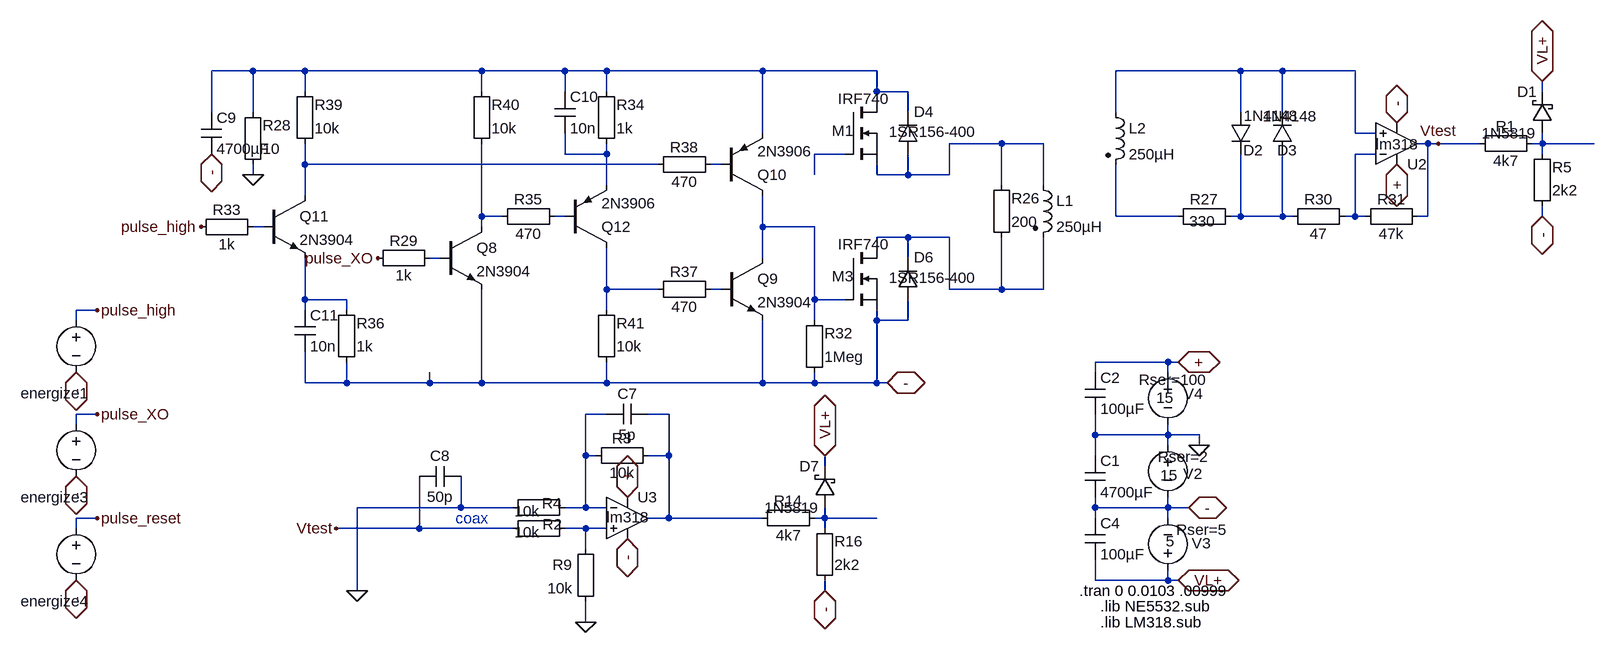
[diagram p0: schematic metal_low_power_fast_switch_ZVT_10.asc]
metal_low_power_fast_switch_ZVT_10.asc, the LTspice schematic file:
Version 4
SHEET 1 6068 1612
WIRE 96 -2432 32 -2432
WIRE 176 -2432 96 -2432
WIRE 448 -2432 176 -2432
WIRE 576 -2432 448 -2432
WIRE 640 -2432 576 -2432
WIRE 880 -2432 640 -2432
WIRE 1056 -2432 880 -2432
WIRE 1616 -2432 1424 -2432
WIRE 1680 -2432 1616 -2432
WIRE 1792 -2432 1680 -2432
WIRE 176 -2400 176 -2432
WIRE 448 -2400 448 -2432
WIRE 576 -2400 576 -2432
WIRE 640 -2400 640 -2432
WIRE 1056 -2400 1056 -2432
WIRE 1104 -2400 1056 -2400
WIRE 2080 -2400 2080 -2416
WIRE 1056 -2384 1056 -2400
WIRE 32 -2368 32 -2432
WIRE 96 -2368 96 -2432
WIRE 1104 -2368 1104 -2400
WIRE 1424 -2368 1424 -2432
WIRE 1616 -2368 1616 -2432
WIRE 1680 -2368 1680 -2432
WIRE 880 -2336 880 -2432
WIRE 1792 -2336 1792 -2432
WIRE 1824 -2336 1792 -2336
WIRE 1248 -2320 1168 -2320
WIRE 1312 -2320 1248 -2320
WIRE 1904 -2320 1888 -2320
WIRE 1920 -2320 1904 -2320
WIRE 1984 -2320 1920 -2320
WIRE 2080 -2320 2080 -2336
WIRE 2080 -2320 2064 -2320
WIRE 2160 -2320 2080 -2320
WIRE 576 -2304 576 -2336
WIRE 640 -2304 640 -2320
WIRE 640 -2304 576 -2304
WIRE 1008 -2304 960 -2304
WIRE 1824 -2304 1792 -2304
WIRE 2080 -2304 2080 -2320
WIRE 176 -2288 176 -2320
WIRE 720 -2288 176 -2288
WIRE 816 -2288 800 -2288
WIRE 96 -2272 96 -2288
WIRE 960 -2272 960 -2304
WIRE 1056 -2272 1056 -2288
WIRE 1104 -2272 1104 -2304
WIRE 1104 -2272 1056 -2272
WIRE 1168 -2272 1168 -2320
WIRE 1168 -2272 1104 -2272
WIRE 640 -2256 640 -2304
WIRE 1248 -2256 1248 -2320
WIRE 1312 -2256 1312 -2320
WIRE 176 -2240 176 -2288
WIRE 448 -2208 448 -2320
WIRE 480 -2208 448 -2208
WIRE 576 -2208 560 -2208
WIRE 1424 -2208 1424 -2288
WIRE 1520 -2208 1424 -2208
WIRE 1616 -2208 1616 -2304
WIRE 1616 -2208 1600 -2208
WIRE 1680 -2208 1680 -2304
WIRE 1680 -2208 1616 -2208
WIRE 1696 -2208 1680 -2208
WIRE 1792 -2208 1792 -2304
WIRE 1792 -2208 1776 -2208
WIRE 1808 -2208 1792 -2208
WIRE 1904 -2208 1904 -2320
WIRE 1904 -2208 1888 -2208
WIRE 2080 -2208 2080 -2224
WIRE 112 -2192 96 -2192
WIRE 448 -2192 448 -2208
WIRE 880 -2192 880 -2240
WIRE 960 -2192 880 -2192
WIRE 1104 -2176 1056 -2176
WIRE 1168 -2176 1104 -2176
WIRE 1056 -2160 1056 -2176
WIRE 384 -2144 368 -2144
WIRE 880 -2144 880 -2192
WIRE 1104 -2144 1104 -2176
WIRE 640 -2096 640 -2160
WIRE 720 -2096 640 -2096
WIRE 816 -2096 800 -2096
WIRE 1168 -2096 1168 -2176
WIRE 1248 -2096 1248 -2176
WIRE 1248 -2096 1168 -2096
WIRE 1312 -2096 1312 -2176
WIRE 1312 -2096 1248 -2096
WIRE 176 -2080 176 -2144
WIRE 240 -2080 176 -2080
WIRE 960 -2080 960 -2192
WIRE 1008 -2080 960 -2080
WIRE -144 -2064 -176 -2064
WIRE 176 -2064 176 -2080
WIRE 240 -2064 240 -2080
WIRE 640 -2064 640 -2096
WIRE -176 -2048 -176 -2064
WIRE 960 -2048 960 -2080
WIRE 1056 -2048 1056 -2064
WIRE 1104 -2048 1104 -2080
WIRE 1104 -2048 1056 -2048
WIRE 1504 -1984 1392 -1984
WIRE 1520 -1984 1504 -1984
WIRE 1392 -1968 1392 -1984
WIRE 1504 -1968 1504 -1984
WIRE 176 -1952 176 -2000
WIRE 240 -1952 240 -1984
WIRE 240 -1952 176 -1952
WIRE 368 -1952 368 -1968
WIRE 368 -1952 240 -1952
WIRE 448 -1952 448 -2096
WIRE 448 -1952 368 -1952
WIRE 640 -1952 640 -1984
WIRE 640 -1952 448 -1952
WIRE 880 -1952 880 -2048
WIRE 880 -1952 640 -1952
WIRE 960 -1952 960 -1968
WIRE 960 -1952 880 -1952
WIRE 1056 -1952 1056 -2048
WIRE 1056 -1952 960 -1952
WIRE 1072 -1952 1056 -1952
WIRE -144 -1904 -176 -1904
WIRE 640 -1904 608 -1904
WIRE 736 -1904 704 -1904
WIRE -176 -1888 -176 -1904
WIRE 1392 -1872 1392 -1904
WIRE 1504 -1872 1504 -1888
WIRE 1504 -1872 1392 -1872
WIRE 1552 -1872 1504 -1872
WIRE 1504 -1856 1504 -1872
WIRE 1552 -1856 1552 -1872
WIRE 608 -1840 608 -1904
WIRE 624 -1840 608 -1840
WIRE 736 -1840 736 -1904
WIRE 736 -1840 704 -1840
WIRE 1392 -1840 1392 -1872
WIRE 976 -1824 976 -1840
WIRE 416 -1760 416 -1808
WIRE 416 -1760 256 -1760
WIRE 496 -1760 416 -1760
WIRE 608 -1760 608 -1840
WIRE 608 -1760 576 -1760
WIRE 640 -1760 608 -1760
WIRE 1392 -1760 1392 -1776
WIRE 1504 -1760 1504 -1776
WIRE 1504 -1760 1392 -1760
WIRE 1536 -1760 1504 -1760
WIRE -144 -1744 -176 -1744
WIRE 736 -1744 736 -1840
WIRE 736 -1744 704 -1744
WIRE 880 -1744 736 -1744
WIRE 976 -1744 976 -1760
WIRE 976 -1744 960 -1744
WIRE 1056 -1744 976 -1744
WIRE 1392 -1744 1392 -1760
WIRE 1504 -1744 1504 -1760
WIRE -176 -1728 -176 -1744
WIRE 352 -1728 352 -1808
WIRE 352 -1728 224 -1728
WIRE 496 -1728 352 -1728
WIRE 608 -1728 576 -1728
WIRE 640 -1728 608 -1728
WIRE 976 -1728 976 -1744
WIRE 608 -1696 608 -1728
WIRE 1392 -1648 1392 -1680
WIRE 1504 -1648 1504 -1664
WIRE 1504 -1648 1392 -1648
WIRE 1520 -1648 1504 -1648
WIRE 256 -1632 256 -1760
WIRE 976 -1632 976 -1648
WIRE 608 -1584 608 -1616
FLAG 1536 -1760 -
IOPIN 1536 -1760 BiDir
FLAG 1520 -1984 +
IOPIN 1520 -1984 BiDir
FLAG 1552 -1856 0
FLAG 1520 -1648 VL+
IOPIN 1520 -1648 BiDir
FLAG 976 -1632 -
IOPIN 976 -1632 BiDir
FLAG 976 -1840 VL+
IOPIN 976 -1840 BiDir
FLAG 672 -1776 +
IOPIN 672 -1776 BiDir
FLAG 672 -1712 -
IOPIN 672 -1712 BiDir
FLAG 224 -1728 Vtest
FLAG 608 -1584 0
FLAG 256 -1632 0
FLAG 32 -2304 -
IOPIN 32 -2304 BiDir
FLAG 96 -2272 0
FLAG 1856 -2288 +
IOPIN 1856 -2288 BiDir
FLAG 1856 -2352 -
IOPIN 1856 -2352 BiDir
FLAG 1072 -1952 -
IOPIN 1072 -1952 BiDir
FLAG 1920 -2320 Vtest
FLAG 2080 -2208 -
IOPIN 2080 -2208 BiDir
FLAG 2080 -2416 VL+
IOPIN 2080 -2416 BiDir
FLAG -176 -1968 -
IOPIN -176 -1968 BiDir
FLAG -144 -2064 pulse_high
FLAG -176 -1808 -
IOPIN -176 -1808 BiDir
FLAG -144 -1904 pulse_XO
FLAG -176 -1648 -
IOPIN -176 -1648 BiDir
FLAG -144 -1744 pulse_reset
FLAG 288 -2144 pulse_XO
FLAG 16 -2192 pulse_high
SYMBOL voltage 1504 -1872 M0
WINDOW 123 0 0 Left 2
WINDOW 39 -63 34 Left 2
WINDOW 0 -53 60 Left 2
WINDOW 3 -15 62 Left 2
SYMATTR SpiceLine Rser=2
SYMATTR InstName V2
SYMATTR Value 15
SYMBOL voltage 1504 -1984 M0
WINDOW 123 0 0 Left 2
WINDOW 39 -61 27 Left 2
WINDOW 0 -54 49 Left 2
WINDOW 3 -9 55 Left 2
SYMATTR SpiceLine Rser=100
SYMATTR InstName V4
SYMATTR Value 15
SYMBOL voltage 1504 -1648 M180
WINDOW 123 0 0 Left 2
WINDOW 39 13 78 Left 2
WINDOW 0 37 57 Left 2
WINDOW 3 -3 60 Left 2
SYMATTR SpiceLine Rser=5
SYMATTR InstName V3
SYMATTR Value 5
SYMBOL Misc\\EuropeanCap 1376 -1840 R0
SYMATTR InstName C1
SYMATTR Value 4700µF
SYMATTR SpiceLine V=400 Irms=1 Rser=.32 Lser=0
SYMBOL Misc\\EuropeanCap 1376 -1968 R0
SYMATTR InstName C2
SYMATTR Value 100µF
SYMATTR SpiceLine V=400 Irms=1 Rser=.32 Lser=0
SYMBOL Misc\\EuropeanCap 1376 -1744 R0
SYMATTR InstName C4
SYMATTR Value 100µF
SYMATTR SpiceLine V=400 Irms=1 Rser=.32 Lser=0
SYMBOL Misc\\EuropeanResistor 864 -1728 R270
WINDOW 0 27 56 VTop 2
WINDOW 3 5 56 VBottom 2
SYMATTR InstName R14
SYMATTR Value 4k7
SYMBOL Misc\\EuropeanResistor 960 -1632 M180
WINDOW 0 31 76 Left 2
WINDOW 3 31 40 Left 2
SYMATTR InstName R16
SYMATTR Value 2k2
SYMBOL schottky 992 -1760 R180
WINDOW 0 24 64 Left 2
WINDOW 3 24 0 Left 2
SYMATTR InstName D7
SYMATTR Value 1N5819
SYMATTR Description Diode
SYMATTR Type diode
SYMBOL Opamps\\opamp2 672 -1808 R0
WINDOW 3 -32 63 Left 2
SYMATTR Value lm318
SYMATTR InstName U3
SYMBOL Misc\\EuropeanResistor 608 -1856 M90
WINDOW 0 5 56 VBottom 2
WINDOW 3 27 56 VTop 2
SYMATTR InstName R3
SYMATTR Value 10k
SYMBOL Misc\\EuropeanCap 704 -1888 M270
WINDOW 0 32 32 VTop 2
WINDOW 3 0 32 VBottom 2
SYMATTR InstName C7
SYMATTR Value 5p
SYMATTR SpiceLine V=400 Irms=1 Rser=.32 Lser=0
SYMBOL Misc\\EuropeanCap 416 -1792 M270
WINDOW 0 32 32 VTop 2
WINDOW 3 0 32 VBottom 2
SYMATTR InstName C8
SYMATTR Value 50p
SYMATTR SpiceLine V=400 Irms=1 Rser=.32 Lser=0
SYMBOL Misc\\EuropeanResistor 480 -1744 M90
WINDOW 0 25 77 VBottom 2
WINDOW 3 6 38 VTop 2
SYMATTR InstName R2
SYMATTR Value 10k
SYMBOL Misc\\EuropeanResistor 624 -1712 M0
SYMATTR InstName R9
SYMATTR Value 10k
SYMBOL Misc\\EuropeanResistor 480 -1776 M90
WINDOW 0 25 76 VBottom 2
WINDOW 3 6 38 VTop 2
SYMATTR InstName R4
SYMATTR Value 10k
SYMBOL Misc\\EuropeanCap 16 -2368 R0
SYMATTR InstName C9
SYMATTR Value 4700µF
SYMATTR SpiceLine V=400 Irms=1 Rser=.32 Lser=0
SYMBOL Misc\\EuropeanResistor 1232 -2160 M180
WINDOW 0 31 76 Left 2
WINDOW 3 31 40 Left 2
SYMATTR InstName R26
SYMATTR Value 200
SYMBOL Misc\\EuropeanResistor 1504 -2224 M90
WINDOW 0 5 56 VBottom 2
WINDOW 3 8 53 VTop 2
SYMATTR InstName R27
SYMATTR Value 330
SYMBOL diode 1600 -2368 R0
WINDOW 3 21 5 Left 2
WINDOW 0 20 58 Left 2
SYMATTR Value 1N4148
SYMATTR InstName D2
SYMBOL diode 1696 -2304 R180
WINDOW 0 -7 6 Left 2
WINDOW 3 -39 58 Left 2
SYMATTR InstName D3
SYMATTR Value 1N4148
SYMBOL Misc\\EuropeanResistor 80 -2272 M180
WINDOW 0 31 76 Left 2
WINDOW 3 31 40 Left 2
SYMATTR InstName R28
SYMATTR Value 10
SYMBOL nmos 1008 -2160 R0
WINDOW 0 -21 44 Left 2
WINDOW 3 -12 -5 Left 2
SYMATTR InstName M3
SYMATTR Value IRF740
SYMBOL npn3 384 -2192 R0
SYMATTR InstName Q8
SYMATTR Value 2N3904
SYMBOL Misc\\EuropeanResistor 272 -2160 M90
WINDOW 0 5 56 VBottom 2
WINDOW 3 27 56 VTop 2
SYMATTR InstName R29
SYMATTR Value 1k
SYMBOL Opamps\\opamp2 1856 -2256 M180
WINDOW 3 -32 63 Left 2
SYMATTR Value lm318
SYMATTR InstName U2
SYMBOL Misc\\EuropeanResistor 1680 -2192 R270
WINDOW 0 27 56 VTop 2
WINDOW 3 5 56 VBottom 2
SYMATTR InstName R30
SYMATTR Value 47
SYMBOL Misc\\EuropeanResistor 1792 -2192 R270
WINDOW 0 27 56 VTop 2
WINDOW 3 5 56 VBottom 2
SYMATTR InstName R31
SYMATTR Value 47k
SYMBOL npn3 816 -2144 R0
SYMATTR InstName Q9
SYMATTR Value 2N3904
SYMBOL diode 1120 -2080 R180
WINDOW 0 -24 65 Left 2
WINDOW 3 -90 34 Left 2
SYMATTR InstName D6
SYMATTR Value 1SR156-400
SYMATTR Description Zener Diode
SYMATTR Type zener
SYMBOL pnp2 816 -2240 M180
SYMATTR InstName Q10
SYMATTR Value 2N3906
SYMBOL Misc\\EuropeanResistor 944 -1952 M180
WINDOW 0 31 76 Left 2
WINDOW 3 31 40 Left 2
SYMATTR InstName R32
SYMATTR Value 1Meg
SYMBOL voltage -176 -2064 M0
WINDOW 0 -21 128 Left 2
WINDOW 3 -134 119 Invisible 2
WINDOW 123 0 0 Left 2
SYMATTR InstName energize1
SYMATTR Value PULSE(0 4.8 .01 1e-8 1e-8 .002 .004 1000)
SYMATTR SpiceLine Rser=0
SYMBOL npn3 112 -2240 R0
SYMATTR InstName Q11
SYMATTR Value 2N3904
SYMBOL Misc\\EuropeanResistor 0 -2208 M90
WINDOW 0 5 56 VBottom 2
WINDOW 3 27 56 VTop 2
SYMATTR InstName R33
SYMATTR Value 1k
SYMBOL pnp2 576 -2160 M180
SYMATTR InstName Q12
SYMATTR Value 2N3906
SYMBOL Misc\\EuropeanResistor 624 -2304 M180
WINDOW 0 31 76 Left 2
WINDOW 3 31 40 Left 2
SYMATTR InstName R34
SYMATTR Value 1k
SYMBOL Misc\\EuropeanResistor 464 -2224 M90
WINDOW 0 5 56 VBottom 2
WINDOW 3 27 56 VTop 2
SYMATTR InstName R35
SYMATTR Value 470
SYMBOL Misc\\EuropeanCap 560 -2400 R0
SYMATTR InstName C10
SYMATTR Value 10n
SYMATTR SpiceLine V=400 Irms=1 Rser=.32 Lser=0
SYMBOL Misc\\EuropeanResistor 224 -1968 M180
WINDOW 0 31 76 Left 2
WINDOW 3 31 40 Left 2
SYMATTR InstName R36
SYMATTR Value 1k
SYMBOL Misc\\EuropeanCap 160 -2064 R0
SYMATTR InstName C11
SYMATTR Value 10n
SYMATTR SpiceLine V=400 Irms=1 Rser=.32 Lser=0
SYMBOL Misc\\EuropeanResistor 816 -2080 M270
WINDOW 0 27 56 VTop 2
WINDOW 3 5 56 VBottom 2
SYMATTR InstName R37
SYMATTR Value 470
SYMBOL Misc\\EuropeanResistor 704 -2304 M90
WINDOW 0 5 56 VBottom 2
WINDOW 3 27 56 VTop 2
SYMATTR InstName R38
SYMATTR Value 470
SYMBOL Misc\\EuropeanResistor 160 -2304 M180
WINDOW 0 31 76 Left 2
WINDOW 3 31 40 Left 2
SYMATTR InstName R39
SYMATTR Value 10k
SYMBOL Misc\\EuropeanResistor 432 -2304 M180
WINDOW 0 31 76 Left 2
WINDOW 3 31 40 Left 2
SYMATTR InstName R40
SYMATTR Value 10k
SYMBOL Misc\\EuropeanResistor 624 -1968 M180
WINDOW 0 31 76 Left 2
WINDOW 3 31 40 Left 2
SYMATTR InstName R41
SYMATTR Value 10k
SYMBOL ind2 1296 -2272 R0
SYMATTR InstName L1
SYMATTR Value 250µH
SYMATTR SpiceLine Rser=.4 Cpar=20p
SYMATTR Type ind
SYMBOL Misc\\EuropeanResistor 1968 -2304 R270
WINDOW 0 27 56 VTop 2
WINDOW 3 5 56 VBottom 2
SYMATTR InstName R1
SYMATTR Value 4k7
SYMBOL Misc\\EuropeanResistor 2064 -2208 M180
WINDOW 0 31 76 Left 2
WINDOW 3 31 40 Left 2
SYMATTR InstName R5
SYMATTR Value 2k2
SYMBOL schottky 2096 -2336 R180
WINDOW 0 24 64 Left 2
WINDOW 3 24 0 Left 2
SYMATTR InstName D1
SYMATTR Value 1N5819
SYMATTR Description Diode
SYMATTR Type diode
SYMBOL ind2 1408 -2384 R0
SYMATTR InstName L2
SYMATTR Value 250µH
SYMATTR SpiceLine Rser=.4 Cpar=20p
SYMATTR Type ind
SYMBOL nmos 1008 -2384 R0
WINDOW 0 -21 44 Left 2
WINDOW 3 -12 -5 Left 2
SYMATTR InstName M1
SYMATTR Value IRF740
SYMBOL diode 1120 -2304 R180
WINDOW 0 -24 65 Left 2
WINDOW 3 -90 34 Left 2
SYMATTR InstName D4
SYMATTR Value 1SR156-400
SYMATTR Description Zener Diode
SYMATTR Type zener
SYMBOL voltage -176 -1904 M0
WINDOW 0 -21 128 Left 2
WINDOW 3 -134 119 Invisible 2
WINDOW 123 0 0 Left 2
SYMATTR InstName energize3
SYMATTR Value PULSE(0 4.8 .0102 1e-8 1e-8 .002 .004 1000)
SYMATTR SpiceLine Rser=0
SYMBOL voltage -176 -1744 M0
WINDOW 0 -21 128 Left 2
WINDOW 3 -134 119 Invisible 2
WINDOW 123 0 0 Left 2
SYMATTR InstName energize4
SYMATTR Value PULSE(0 4.8 .0104 1e-8 1e-8 .002 .004 1000)
SYMATTR SpiceLine Rser=0
TEXT 1368 -1632 Left 2 !.tran 0 0.0103 .00999
TEXT 1400 -1608 Left 2 !.lib NE5532.sub
TEXT 1400 -1584 Left 2 !.lib LM318.sub
TEXT 408 -1744 Left 2 ;coax

The netlist it stands for:
* metal_low_power_fast_switch_ZVT_10.asc
V2 0 - 15 Rser=2
V4 + 0 15 Rser=100
V3 VL+ - 5 Rser=5
C1 0 - 4700µF V=400 Irms=1 Rser=.32 Lser=0
C2 + 0 100µF V=400 Irms=1 Rser=.32 Lser=0
C4 - VL+ 100µF V=400 Irms=1 Rser=.32 Lser=0
R14 N022 N023 4k7
R16 - N023 2k2
D7 N023 VL+ 1N5819
XU3 N024 N021 + - N022 lm318  ; pins In+ In- V+ V- OUT
R3 N021 N022 10k
C7 N022 N021 5p V=400 Irms=1 Rser=.32 Lser=0
C8 0 Vtest 50p V=400 Irms=1 Rser=.32 Lser=0
R2 Vtest N024 10k
R9 N024 0 10k
R4 0 N021 10k
C9 N001 - 4700µF V=400 Irms=1 Rser=.32 Lser=0
R26 N016 N003 200
R27 N012 N013 330
D2 N002 N013 1N4148
D3 N013 N002 1N4148
R28 0 N001 10
M3 N016 N015 - - IRF740
Q8 N010 N017 - 0 2N3904
R29 pulse_XO N017 1k
XU2 N002 N007 + - Vtest lm318  ; pins In+ In- V+ V- OUT
R30 N013 N007 47
R31 N007 Vtest 47k
Q9 N015 N019 - 0 2N3904
D6 - N016 1SR156-400
Q10 N015 N009 N001 0 2N3906
R32 - N015 1Meg
V§energize1 pulse_high - PULSE(0 4.8 .01 1e-8 1e-8 .002 .004 1000) Rser=0
Q11 N008 N014 N020 0 2N3904
R33 pulse_high N014 1k
Q12 N018 N011 N005 0 2N3906
R34 N005 N001 1k
R35 N010 N011 470
C10 N001 N005 10n V=400 Irms=1 Rser=.32 Lser=0
R36 - N020 1k
C11 N020 - 10n V=400 Irms=1 Rser=.32 Lser=0
R37 N019 N018 470
R38 N008 N009 470
R39 N008 N001 10k
R40 N010 N001 10k
R41 - N018 10k
L1 N003 N016 250µH Rser=.4 Cpar=20p
R1 Vtest N004 4k7
R5 - N004 2k2
D1 N004 VL+ 1N5819
L2 N002 N012 250µH Rser=.4 Cpar=20p
M1 N001 N006 N003 N003 IRF740
D4 N003 N001 1SR156-400
V§energize3 pulse_XO - PULSE(0 4.8 .0102 1e-8 1e-8 .002 .004 1000) Rser=0
V§energize4 pulse_reset - PULSE(0 4.8 .0104 1e-8 1e-8 .002 .004 1000) Rser=0
.model D D
.lib standard.dio
.model NPN NPN
.model PNP PNP
.lib standard.bjt
.model NMOS NMOS
.model PMOS PMOS
.lib standard.mos
.tran 0 0.0103 .00999
.lib NE5532.sub
.lib LM318.sub
* coax
.backanno
.end